# EAGLE design usb-serial (EAGLE 8.4.3)
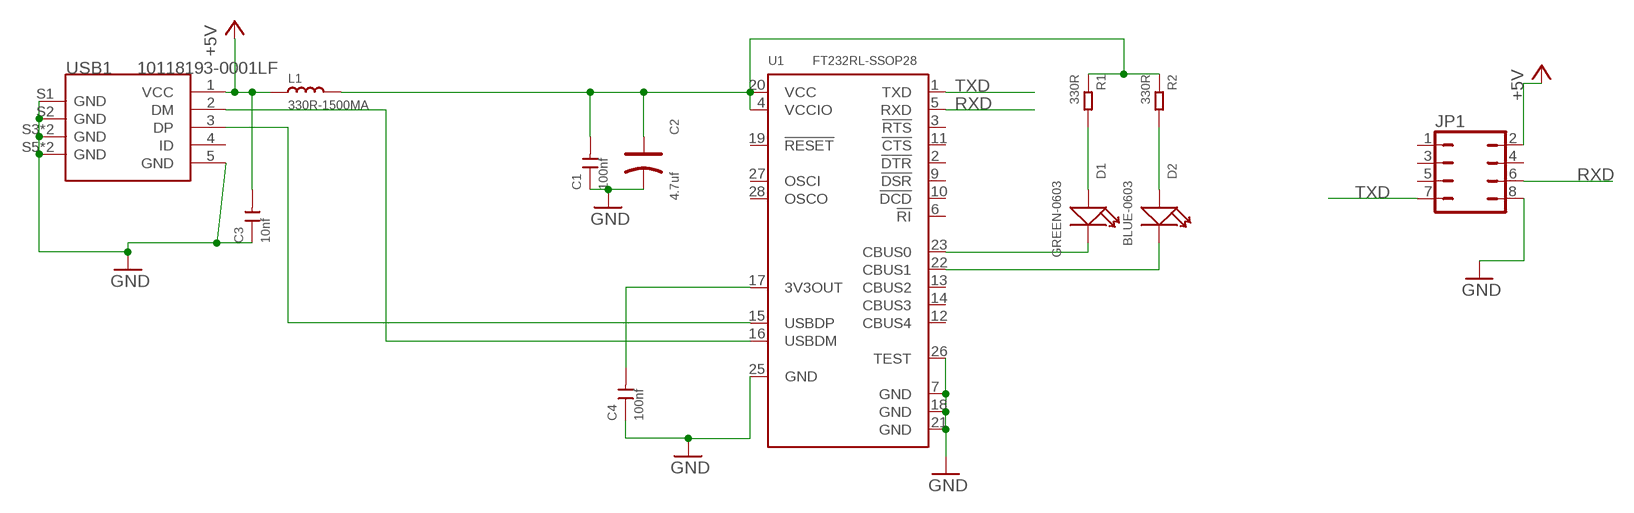
[diagram p0: schematic, sheet 1]

## Parts
C1  100nf  CERAMIC-100NF-50V-10%-X7R(0603)  [C0603]
C2  4.7uf  TANTALUM-SMD-4.7UF-16V(AVX-A)  [AVX-A]
C3  10nf  CERAMIC-10NF-50V-10%-X7R(0603)  [C0603]
C4  100nf  CERAMIC-100NF-50V-10%-X7R(0603)  [C0603]
D1  GREEN-0603  SMD-LED-CLEAR-GREEN(0603)  [LED-0603]
D2  BLUE-0603  SMD-LED-CLEAR-BLUE(0603)  [LED-0603]
JP1  JP4Q  [JP4Q]
L1  330R-1500MA  SMD-FERRITE-BEAD-330R-1500MA(0805)'0805'  [L0805]
R1  330R  SMD-RES-330R-1%-1/10W(0603)  [R0603]
R2  330R  SMD-RES-330R-1%-1/10W(0603)  [R0603]
U1  FT232RL-SSOP28  INTERFACE-FT232RL(SSOP28)  [SSOP28-0.65-10.2X5.2MM]
USB1  10118193-0001LF  MICRO-USB-SMD-B-(10118193-0001LF)  [MICRO-USB5+6P-SMD-0.65-B]

## Nets
+5V: C3.2 JP1.2 L1.1 USB1.1(VCC)
GND: C1.1 C2.- C3.1 C4.1 JP1.8 U1.7(GND) U1.18(GND) U1.21(GND) U1.25(GND) U1.26(TEST) USB1.5(GND) USB1.S1(GND) USB1.S2(GND) USB1.S3(GND) USB1.S4(GND) USB1.S5(GND) USB1.S6(GND)
N$1: D1.+ R1.2
N$2: D2.+ R2.2
N$4: C1.2 C2.+ L1.2 R1.1 R2.1 U1.4(VCCIO) U1.20(VCC)
N$6: U1.15(USBDP) USB1.3(DP)
N$7: U1.16(USBDM) USB1.2(DM)
N$8: C4.2 U1.17(3V3OUT)
N$11: D1.- U1.23(CBUS0)
N$12: D2.- U1.22(CBUS1)
RXD: JP1.6 U1.5(RXD)
TXD: JP1.7 U1.1(TXD)
Unconnected: JP1.1 JP1.3 JP1.4 JP1.5 U1.2(!DTR) U1.3(!RTS) U1.6(!RI) U1.9(!DSR) U1.10(!DCD) U1.11(!CTS) U1.12(CBUS4) U1.13(CBUS2) U1.14(CBUS3) U1.19(!RESET) U1.27(OSCI) U1.28(OSCO) USB1.4(ID)

## Library data of the parts
C1 C4 = Seeed-Capacitor-2016:CERAMIC-100NF-50V-10%-X7R(0603): 302010138; MPN: CC0603KRX7R9BB104
C2 = Seeed-Capacitor:TANTALUM-SMD-4.7UF-16V(AVX-A): 302020006; MPN: TAJA475*016#NJ
C3 = Seeed-Capacitor:CERAMIC-10NF-50V-10%-X7R(0603): 302010140; MPN: CC0603KRX7R9BB103
D1 = Seeed-LED:SMD-LED-CLEAR-GREEN(0603): 304090043; MPN: 19-217-G7C-AN1P2-3T
D2 = Seeed-LED:SMD-LED-CLEAR-BLUE(0603): 304090045; MPN: 19-217-BHC-ZL1M2RY-3T
JP1 = jumper:JP4Q: JUMPER
L1 = Seeed-Inductor:SMD-FERRITE-BEAD-330R-1500MA(0805): 303030006; MPN: BLM21PG331SN1D
R1 R2 = Seeed-Resistor:SMD-RES-330R-1%-1/10W(0603): 301010300; MPN: RC0603FR-07330RL
U1 = Seeed-IC:INTERFACE-FT232RL(SSOP28): 310070022; MPN: FT232RL
USB1 = Seeed-Connector -2016:MICRO-USB-SMD-B-(10118193-0001LF): 320010003; MPN: 10118193-0001LF

## Board
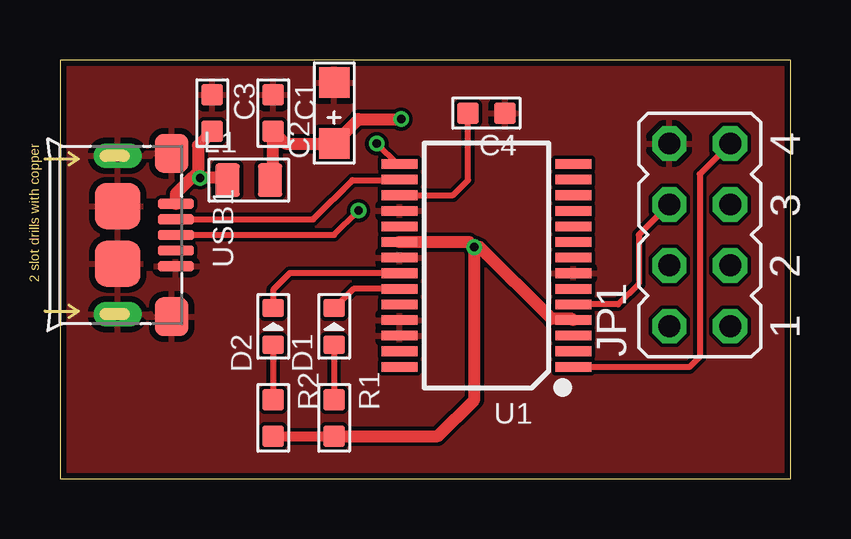
[diagram p1: board, top side]
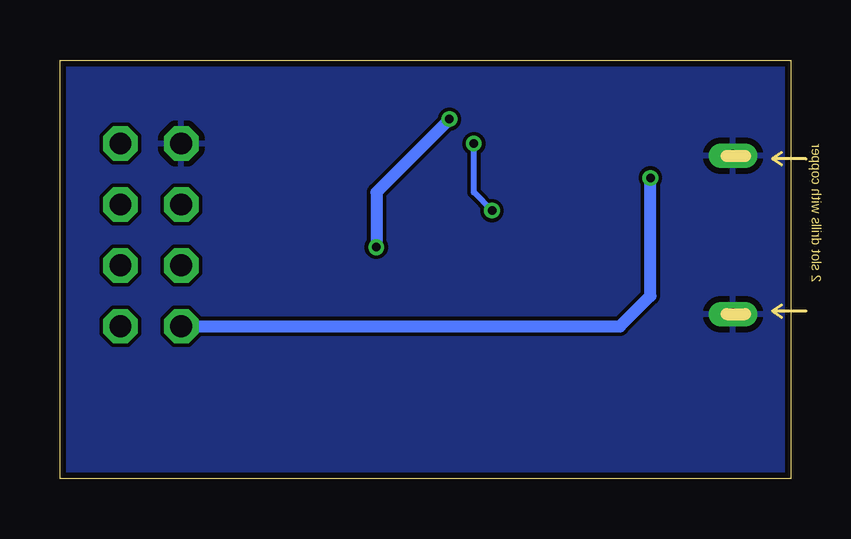
[diagram p2: board, bottom side, seen from below]

Size 30.46 x 17.45 mm. Coordinates in mm from the lower left corner, seen from the top.
Outline: 0,0 30.46,0 30.46,17.45 0,17.45 0,0
Copper layers (1*16): Top 0.035mm / dielectric 1.5mm / Bottom 0.035mm
Design rules "SeeedStudio_2layer_DRU_no_angle_20140221": minimum track width 6mil, minimum drill 12mil, track to track 6mil, track to pad 6mil, pad to pad 6mil, via to via 6mil, smd to smd 0mil, copper to edge 10mil, drill to drill 10mil, minimum pad ring 10mil, minimum via ring 6mil, stop-mask expansion 2mil, vias tented up to drill 100mil, thermal gap 10mil

### Footprints (pad centres in the part's own frame; a part is rotated, then mirrored left to right if it is on the bottom)
C0603 = smd 0.889 x 0.889: 1 0,0.762; 2 0,-0.762
AVX-A = smd 1.27 x 1.27: + -1.27,0; - 1.27,0
LED-0603 = smd 0.762 x 0.889: + -0.762,0; - 0.762,0
JP4Q = drill 0.914 octagon: 1 -3.81,-1.27; 2 -3.81,1.27; 3 -1.27,-1.27; 4 -1.27,1.27; 5 1.27,-1.27; 6 1.27,1.27; 7 3.81,-1.27; 8 3.81,1.27
L0805 = smd 1.016 x 1.397: 1 -0.889,0; 2 0.889,0
R0603 = smd 0.889 x 0.889: 1 0,0.762; 2 0,-0.762
SSOP28-0.65-10.2X5.2MM = smd 0.4 x 1.5: 1 -4.225,-3.625; 2 -3.575,-3.625; 3 -2.925,-3.625; 4 -2.275,-3.625; 5 -1.625,-3.625; 6 -0.975,-3.625; 7 -0.325,-3.625; 8 0.325,-3.625; 9 0.975,-3.625; 10 1.625,-3.625; 11 2.275,-3.625; 12 2.925,-3.625; 13 3.575,-3.625; 14 4.225,-3.625; 15 4.225,3.625; 16 3.575,3.625; 17 2.925,3.625; 18 2.275,3.625; 19 1.625,3.625; 20 0.975,3.625; 21 0.325,3.625; 22 -0.325,3.625; 23 -0.975,3.625; 24 -1.625,3.625; 25 -2.275,3.625; 26 -2.925,3.625; 27 -3.575,3.625; 28 -4.225,3.625
MICRO-USB5+6P-SMD-0.65-B = smd 0.4 x 1.5: 1 -1.3,-0.25; 2 -0.65,-0.25; 3 0,-0.25; 4 0.65,-0.25; 5 1.3,-0.25 | smd 1.6 x 1.4: S1 -3.4,-0.427; S6 3.4,-0.427 | drill 0.508 pad 1.016 long: S2 -3.3,-2.675; S5 3.3,-2.675 | smd 1.9 x 1.9: S3 -1.2,-2.675; S4 1.2,-2.675

### Placement (x,y rotation side)
C1  8.89,15.24 0 top
C2  11.43,15.24 90 top
C3  6.35,15.24 0 top
C4  17.78,15.24 270 top
D1  11.43,6.35 90 top
D2  8.89,6.35 90 top
JP1  26.67,10.16 90 top
L1  7.87,12.45 0 top
R1  11.43,2.54 180 top
R2  8.89,2.54 180 top
U1  17.78,8.89 90 top
USB1  5.08,10.16 270 top

### Tracks (layer width: path | path; a pad name or v marks a point on that pad's centre or on a via)
+5V  (via drill 0.35)
  Top 0.508: C3.2 5.76,13.89 5.76,12.8 5.62,12.66 | USB1.1 4.83,11.87 5.5,12.54 | 5.5,12.54 5.62,12.66 | L1.1 6.9,12.54 v5.84,12.54 | v5.84,12.54 5.5,12.54 | 5.62,12.66 5.75,12.54 v5.84,12.54
  Bottom 0.508: JP1.2 7.11,6.35 5.84,7.62 v5.84,12.54
GND
  pour Bottom: -1.27,19.05 -1.27,-1.27 31.75,-1.27 31.75,19.05
  pour Top: -1.27,17.78 -1.27,-1.27 31.75,-1.27 31.75,17.78
N$1
  Top 0.254: D1.+ R1.2
N$2
  Top 0.254: D2.+ R2.2
N$4  (via drill 0.35)
  Top 0.406: R2.1 R1.1
  Top 0.508: L1.2 8.89,12.57 C1.2 9.4,13.97 C2.+ 12.45,14.99 v14.22,14.99 | v17.27,9.65 17.06,9.87 U1.20 | U1.4 21.36,6.66 20.49,6.66 17.49,9.65 v17.27,9.65 | R1.1 15.75,1.78 17.27,3.3 v17.27,9.65
  Bottom 0.508: v14.22,14.99 17.27,11.94 v17.27,9.65
N$6  (via drill 0.35)
  Top 0.254: USB1.3 11.43,10.16 v12.45,11.18 | v13.21,13.97 14.06,13.12 U1.15
  Bottom 0.254: v12.45,11.18 13.21,11.94 v13.21,13.97
N$7
  Top 0.254: USB1.2 10.56,10.81 12.19,12.45 14.14,12.45 U1.16
N$8
  Top 0.254: C4.2 17.02,12.45 16.39,11.81 U1.17
N$11
  Top 0.254: U1.23 12.23,7.92 D1.-
N$12
  Top 0.254: U1.22 9.58,8.56 8.89,7.87 D2.-
RXD
  Top 0.254: JP1.6 24.13,10.16 24.13,8.13 23.27,7.26 U1.5
TXD
  Top 0.254: JP1.7 26.67,12.7 26.67,5.08 26.24,4.65 21.42,4.65 U1.1